# EAGLE design Zio Qwiic UV Sensor VEML6075 (EAGLE 9.1.1)
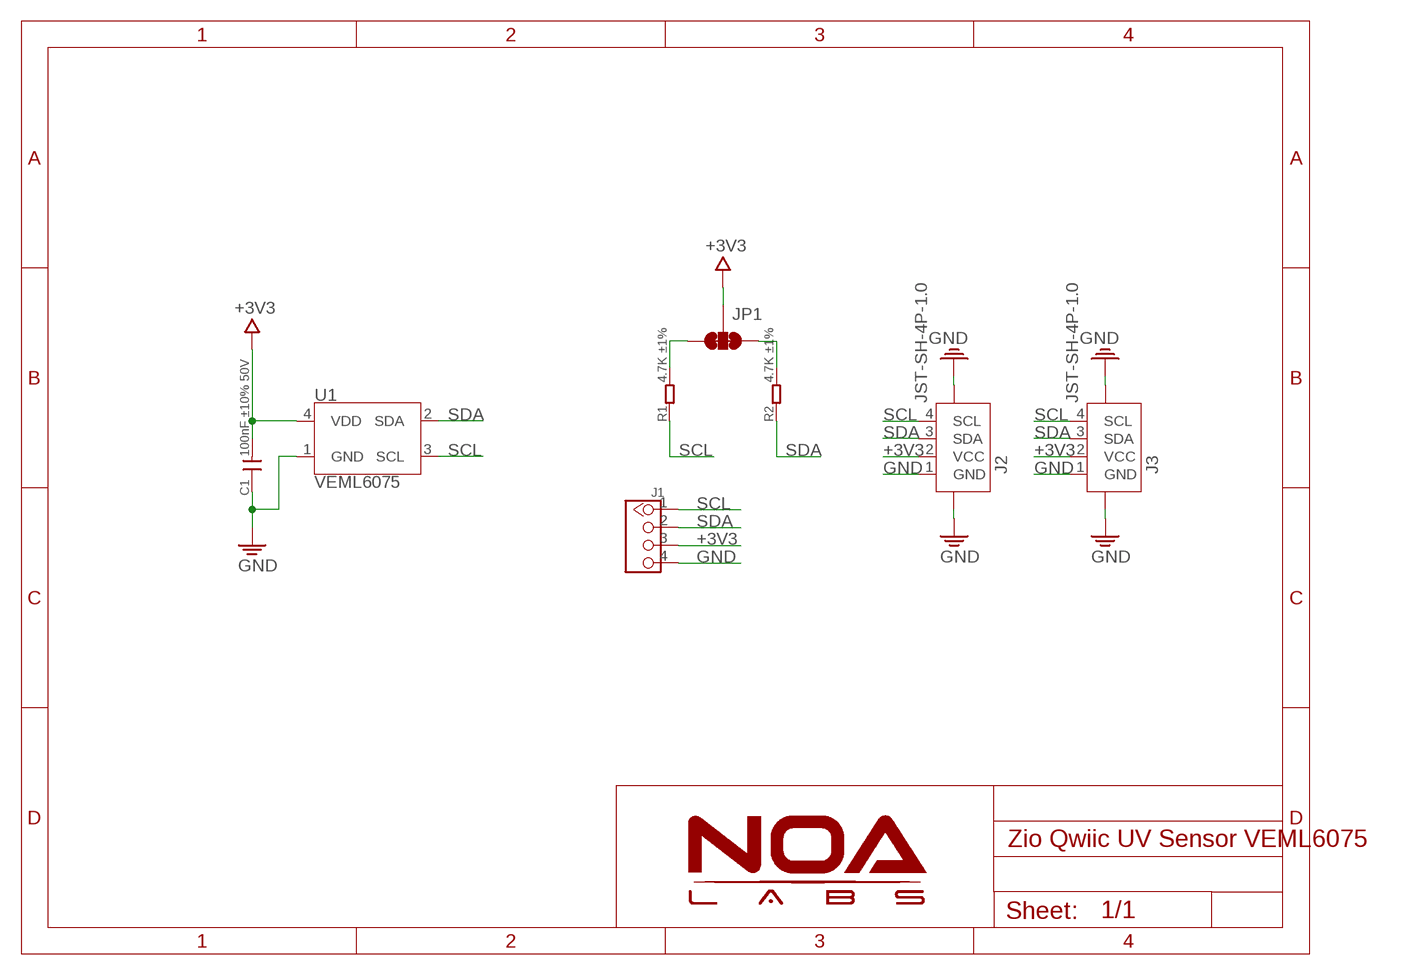
[diagram p0: schematic, sheet 1]

## Parts
C1  100nF ±10% 50V  C-0603  [C0603]
J1  HEADER-4P-60/35MIL  [4P-65/35MIL]
J2  JST-SH-4P-1.0  [JST-SH-4P]
J3  JST-SH-4P-1.0  [JST-SH-4P]
JP1  SMT-JUMPER_3_2-NC_TRACE  [SMT-JUMPER_3_2-NC_TRACE]
R1  4.7K ±1%  R-0603  [R0603]
R2  4.7K ±1%  R-0603  [R0603]
U1  VEML6075  [VEML6075_A3OP]

## Nets
+3V3: C1.2 J1.3 J2.2(VCC) J3.2(VCC) JP1.2 U1.4(VDD)
GND: C1.1 J1.4 J2.1(GND) J2.NC1 J2.NC2 J3.1(GND) J3.NC1 J3.NC2 U1.1(GND)
N$6: JP1.3 R1.2
N$8: JP1.1 R2.2
SCL: J1.1 J2.4(SCL) J3.4(SCL) R1.1 U1.3(SCL)
SDA: J1.2 J2.3(SDA) J3.3(SDA) R2.1 U1.2(SDA)

## Library data of the parts
C1 = RCL:C
J1 = Connector:HEADER-4P
J2 J3 = Connector:JST-SH-4P
JP1 = NOA-Jumpers:SMT-JUMPER_3_2-NC_TRACE
R1 R2 = RCL:R
U1 = IC:VEML6075: Vishay VEML6075 UVA and UVB light sensor with I2C interface.

## Board
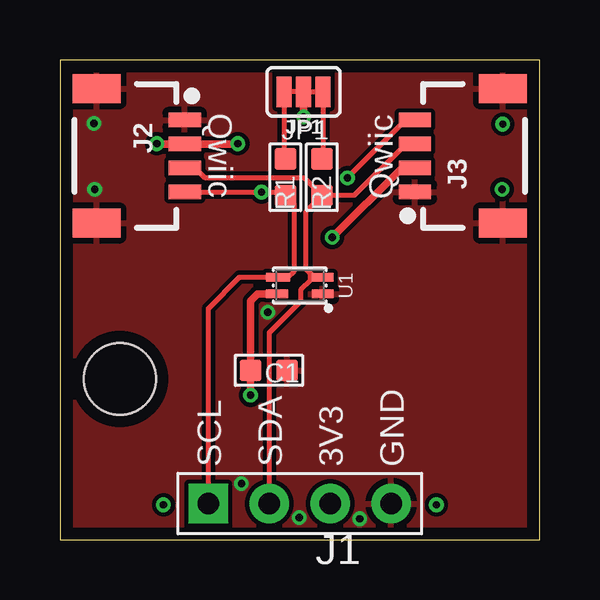
[diagram p1: board, top side]
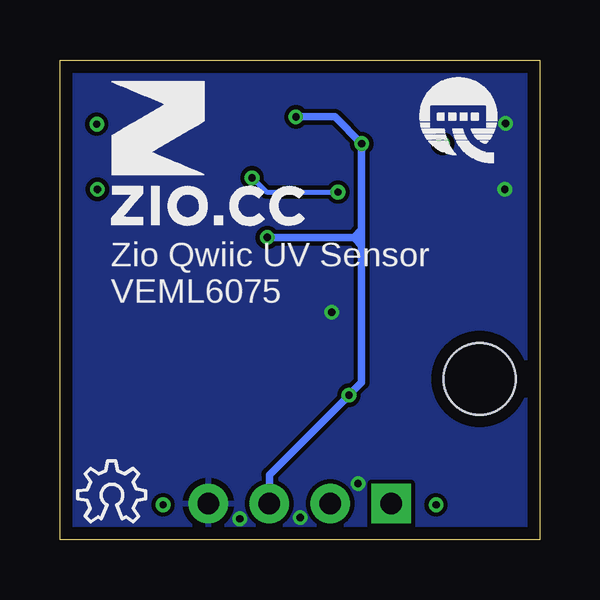
[diagram p2: board, bottom side, seen from below]

Size 20 x 20 mm. Coordinates in mm from the lower left corner, seen from the top.
Outline: 0,0 20,0 20,20 0,20 0,0
Copper layers (1*16): Top 0.035mm / dielectric 1.5mm / Bottom 0.035mm
Design rules "NOA Eagle Rule": minimum track width 7mil, minimum drill 12mil, track to track 7mil, track to pad 7mil, pad to pad 7mil, via to via 7mil, smd to smd 0mil, copper to edge 20mil, drill to drill 10mil, minimum pad ring 10mil, minimum via ring 6mil, stop-mask expansion 2mil, vias tented up to drill 25mil, thermal gap 10mil
Holes 3 mm at 2.5,6.7

### Footprints (pad centres in the part's own frame; a part is rotated, then mirrored left to right if it is on the bottom)
C0603 = smd 0.889 x 0.889: 1 -0.762,0; 2 0.762,0
4P-65/35MIL = drill 0.889 pad 1.651 square: 1 0,3.81 | drill 0.889 pad 1.651: 2 0,1.27; 3 0,-1.27; 4 0,-3.81
JST-SH-4P = smd 0.6 x 1.35: 1 1.5,0; 2 0.5,0; 3 -0.5,0; 4 -1.5,0 | smd 1.2 x 2: NC1 -2.8,3.675; NC2 2.8,3.675
SMT-JUMPER_3_2-NC_TRACE = smd 0.635 x 1.27: 1 -0.813,0; 2 0,0; 3 0.813,0
R0603 = smd 0.889 x 0.889: 1 -0.762,0; 2 0.762,0
VEML6075_A3OP = smd 0.9 x 0.35: 1 -0.95,0.35; 2 -0.95,-0.35; 4 0.95,0.35 | smd 1 x 0.35: 3 0.9,-0.35

### Placement (x,y rotation side)
C1  8.71,7.06 180 top
J1  10,1.5 90 top
J2  5.2,16 90 top
J3  14.8,16 270 top
JP1  10.16,18.67 180 top
R1  9.4,15.11 90 top
R2  10.92,15.11 90 top
U1  10,10.59 180 top
U$3  [6MM]  17.88,13.11 0 bottom
U$4  [OSHW_6X100_NOTEXT]  19.25,0.74 0 bottom
U$5  [QWIIC-LOGO-BASIC]  3.43,17.48 0 bottom

### Tracks (layer width: path | path; a pad name or v marks a point on that pad's centre or on a via)
+3V3  (via drill 0.3)
  Top 0.305: U1.4 8.24,10.24 7.95,9.96 C1.2 v7.95,6.02 | v4.04,16.51 v4.05,16.5 J2.2 7.41,16.5 v7.42,16.51 | J3.2 14.26,15.5 v11.35,12.6 | JP1.2 v10.16,17.63
  Bottom 0.305: v7.95,6.02 8.14,5.83 | 8.14,5.83 11.27,2.7 J1.3 | 7.42,12.93 7.42,13.13 v7.42,16.51 8.53,17.63 v10.16,17.63 | 7.42,12.93 7.42,12.27 | 7.42,12.27 7.42,6.55 8.14,5.83 | v11.35,12.6 7.75,12.6 | 7.75,12.6 7.42,12.93 | 7.75,12.6 7.42,12.27
GND  (via drill 0.3)
  other vias: 7.57,2.34 9.98,0.91 12.5,0.86 8.66,9.47 1.45,14.61 1.42,17.35
  pour Bottom: 0,19.99 19.99,19.99 19.99,0 0,0
  pour Top: 0,19.99 19.99,19.99 19.99,0 0,0
N$1  (via drill 0.3)
  other vias: 4.32,1.45
N$2  (via drill 0.3)
  other vias: 15.7,1.45
N$3  (via drill 0.3)
  other vias: 18.47,17.32
N$4  (via drill 0.3)
  other vias: 18.44,14.61
N$6
  Top 0.203: JP1.3 9.35,15.93 R1.2
N$8
  Top 0.203: JP1.1 10.97,15.93 R2.2
SCL  (via drill 0.3)
  Top 0.203: J2.4 9.25,14.5 R1.1 | R1.1 9.78,13.97 9.78,11.2 9.52,10.94 U1.3 7.49,10.94 6.19,9.64 J1.1 | J3.4 14.4,17.5 v11.99,15.09 | v8.41,14.49 9.26,14.49 R1.1
  Bottom 0.203: v11.99,15.09 11.39,14.49 v8.41,14.49
SDA
  Top 0.203: U1.2 10.85,10.94 | 10.85,10.94 10.6,10.94 10.45,11.09 | 10.45,11.09 10.26,11.28 10.26,13.69 R2.1 | J2.3 5.63,15.5 6.06,15.07 10.2,15.07 R2.1 | J3.3 14.42,16.5 12.27,14.35 R2.1 | J1.2 8.73,8.63 10.06,9.96 10.06,10.44 10.45,10.83 | 10.45,10.83 10.56,10.94 10.85,10.94 | 10.45,10.83 10.45,11.09

### Text on the board
tPlace: Qwiic | JP1 | Qwiic | SCL | SDA | 3V3 | GND
bPlace: Zio Qwiic UV Sensor / VEML6075